# Altium schematic sheet Jlink_V9.SchDoc
size A4
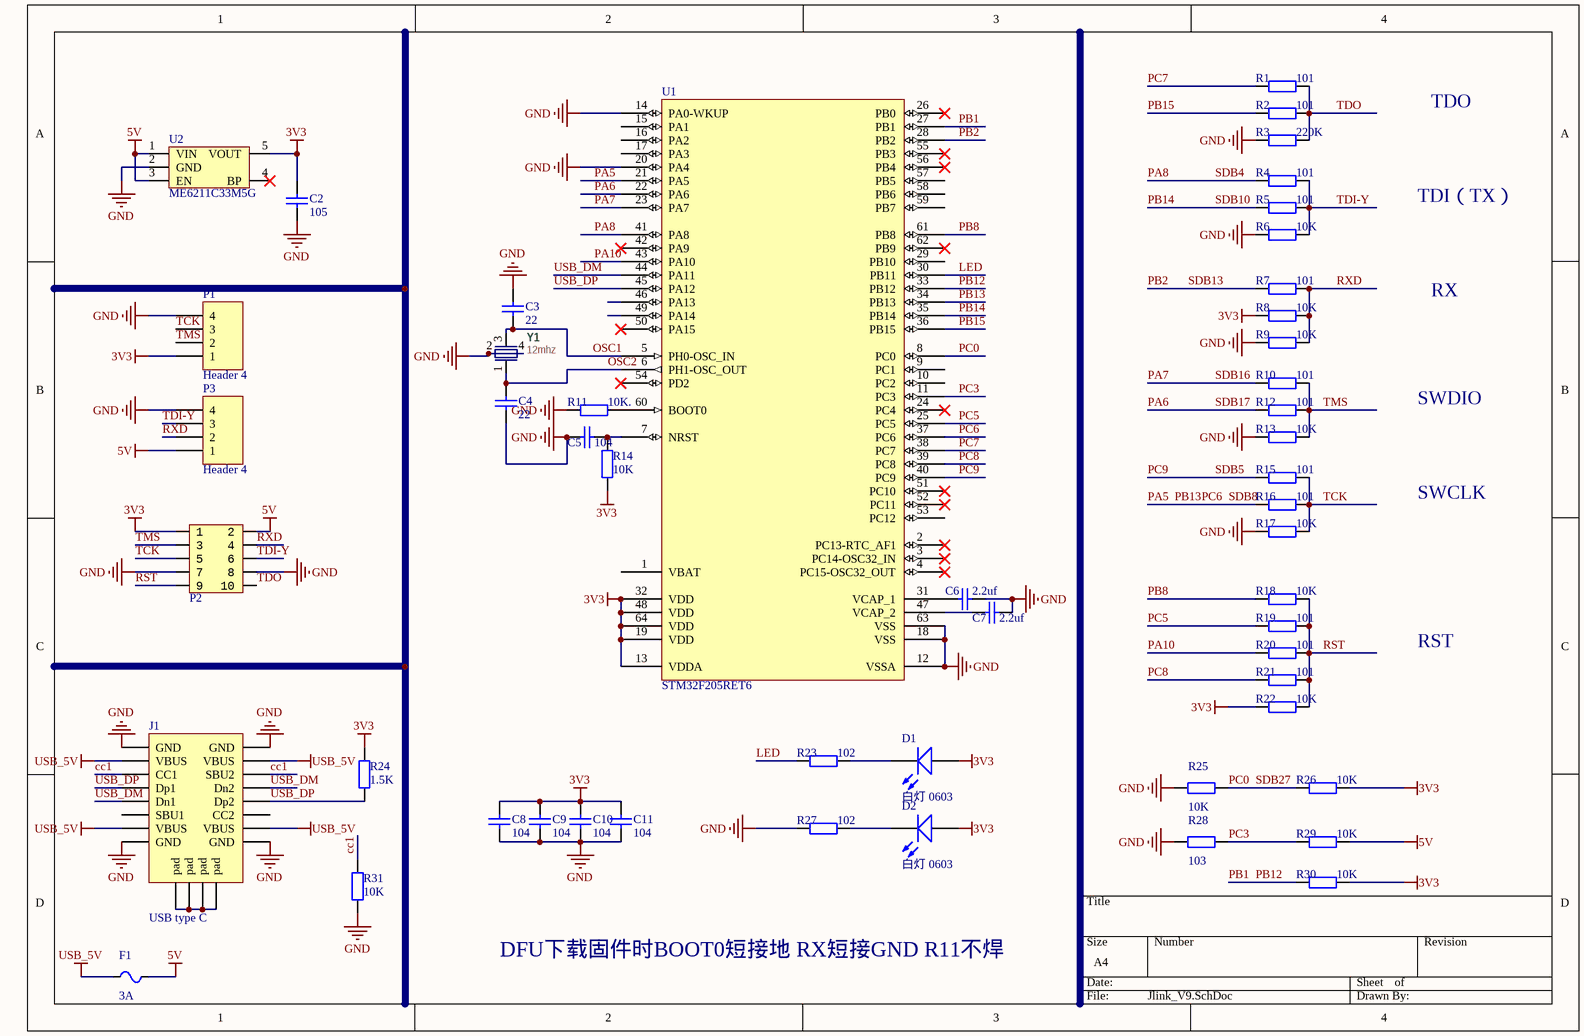
[diagram p0: Jlink_V9.SchDoc]

## Parts
C2  value 105  [LC-0603_C]  (hidden comment: 104)
C3  value 22  [LC-0603_C]  (hidden comment: 104)
C4  value 22  [LC-0603_C]  (hidden comment: 104)
C5  104  [LC-0603_C]
C6  2.2UF  [LC-0603_C]
C7  2.2UF  [LC-0603_C]
C8  104  [LC-0603_C]
C9  104  [LC-0603_C]
C10  104  [LC-0603_C]
C11  104  [LC-0603_C]
D1  白灯 0603  [0603_LED_S1]
D2  白灯 0603  [0603_LED_S1]
F1  3A  [FU 0603]
J1  USB type C  [USB Type-C-16Pin_A]
P1  Header 4  [SMT1.25_4P-90]
P2  HDR2x5  [HDR2X5_2.54_180HF]  (value not drawn)
P3  Header 4  [SMT1.25_4P-90]
R1  value 101  [LC-0603_R]  (hidden comment: 100R)
R2  value 101  [LC-0603_R]  (hidden comment: 100R)
R3  value 220K  [LC-0603_R]  (hidden comment: NC)
R4  value 101  [LC-0603_R]  (hidden comment: 100R)
R5  value 101  [LC-0603_R]  (hidden comment: 100R)
R6  10K  [LC-0603_R]
R7  value 101  [LC-0603_R]  (hidden comment: 100R)
R8  10K  [LC-0603_R]
R9  10K  [LC-0603_R]
R10  value 101  [LC-0603_R]  (hidden comment: 100R)
R11  value 10K.  [LC-0603_R]  (hidden comment: 10K)
R12  value 101  [LC-0603_R]  (hidden comment: 100R)
R13  10K  [LC-0603_R]
R14  10K  [LC-0603_R]
R15  value 101  [LC-0603_R]  (hidden comment: 100R)
R16  value 101  [LC-0603_R]  (hidden comment: 100R)
R17  10K  [LC-0603_R]
R18  10K  [LC-0603_R]
R19  value 101  [LC-0603_R]  (hidden comment: 100R)
R20  value 101  [LC-0603_R]  (hidden comment: 100R)
R21  value 101  [LC-0603_R]  (hidden comment: 10K)
R22  10K  [LC-0603_R]
R23  value 102  [LC-0603_R]  (hidden comment: 1K)
R24  1.5K  [LC-0603_R]
R25  10K  [LC-0603_R]
R26  10K  [LC-0603_R]
R27  value 102  [LC-0603_R]  (hidden comment: 1K)
R28  value 103  [LC-0603_R]  (hidden comment: 10K)
R29  10K  [LC-0603_R]
R30  10K  [LC-0603_R]
R31  10K  [LC-0603_R]
U1  STM32F205RET6  [LQFP64 10x10_N]
U2  ME6211C33M5G  [SOT23-5N]
Y1  12mhz  [OSC-3225]

## Nets
3V3: C2.2 C8.2 C9.2 C10.2 C11.2 D1.A D2.A P1.1 P2.1 R8.1 R14.1 R22.1 R24.1 R26.2 R30.2 U1.13(VDDA) U1.19(VDD) U1.32(VDD) U1.48(VDD) U1.64(VDD) U2.5(VOUT)
5V: F1.2 P2.2 P3.1 R29.2 U2.1(VIN) U2.3(EN)
GND: C2.1 C3.2 C4.1 C5.2 C6.1 C7.1 C8.1 C9.1 C10.1 C11.1 J1.A1(GND) J1.A12(GND) J1.B1(GND) J1.B12(GND) P1.4 P2.7 P2.8 P3.4 R3.1 R6.1 R9.1 R11.1 R13.1 R17.1 R25.1 R27.1 R28.1 R31.2 U1.12(VSSA) U1.14(PA0-WKUP) U1.18(VSS) U1.20(PA4) U1.63(VSS) U2.2(GND) Y1.2 Y1.4
USB_5V: F1.1 J1.A4(VBUS) J1.A9(VBUS) J1.B4(VBUS) J1.B9(VBUS)
cc1: J1.A5(CC1) J1.B8(SBU2) R31.1
LED: R23.1 U1.30(PB11)
OSC1: C3.1 U1.5(PH0-OSC_IN) Y1.3
OSC2: C4.2 U1.6(PH1-OSC_OUT) Y1.1
PA5: R16.1 U1.21(PA5) U1.34(PB13) U1.37(PC6)  [also labelled PB13, PC6, SDB8]
PA6: R12.1 U1.22(PA6)  [also labelled SDB17]
PA7: R10.1 U1.23(PA7)  [also labelled SDB16]
PA8: R4.1 U1.41(PA8)  [also labelled SDB4]
PA10: R20.1 U1.43(PA10)
PB1: R30.1 U1.27(PB1) U1.33(PB12)  [also labelled PB12]
PB2: R7.1 U1.28(PB2)  [also labelled SDB13]
PB8: R18.1 U1.61(PB8)
PB14: R5.1 U1.35(PB14)  [also labelled SDB10]
PB15: R2.1 U1.36(PB15)
PC0: R25.2 R26.1 U1.8(PC0)  [also labelled SDB27]
PC3: R28.2 R29.1 U1.11(PC3)
PC5: R19.1 U1.25(PC5)
PC7: R1.1 U1.38(PC7)
PC8: R21.1 U1.39(PC8)
PC9: R15.1 U1.40(PC9)  [also labelled SDB5]
RST: P2.9 R18.2 R19.2 R20.2 R21.2 R22.2
RXD: P2.4 P3.2 R7.2 R8.2 R9.2
TCK: P1.3 P2.5 R15.2 R16.2 R17.2
TDI-Y: P2.6 P3.3 R4.2 R5.2 R6.2
TDO: P2.10 R1.2 R2.2 R3.2
TMS: P1.2 P2.3 R10.2 R12.2 R13.2
USB_DM: J1.A7(Dn1) J1.B7(Dn2) U1.44(PA11)
USB_DP: J1.A6(Dp1) J1.B6(Dp2) R24.2 U1.45(PA12)
NetC5_1: C5.1 R14.2 U1.7(NRST)
NetC6_2: C6.2 U1.31(VCAP_1)
NetC7_2: C7.2 U1.47(VCAP_2)
NetD1_K: D1.K R23.2
NetD2_K: D2.K R27.2
NetR11_2: R11.2 U1.60(BOOT0)

Not connected (* = marked no-connect by the designer): J1 0(pad) A8(SBU1) B5(CC2); U1 1(VBAT) 2(PC13-RTC_AF1)* 3(PC14-OSC32_IN)* 4(PC15-OSC32_OUT)* 9(PC1) 10(PC2) 15(PA1) 16(PA2) 17(PA3) 24(PC4)* 26(PB0)* 29(PB10) 42(PA9)* 46(PA13) 49(PA14) 50(PA15)* 51(PC10)* 52(PC11)* 53(PC12) 54(PD2)* 55(PB3)* 56(PB4)* 57(PB5) 58(PB6) 59(PB7) 62(PB9)*; U2 4(BP)*

## Notes on the sheet
- TDO
- TDI（TX）
- RX
- SWDIO
- SWCLK
- RST
- DFU下载固件时BOOT0短接地 RX短接GND R11不焊

## Library data of the parts
C2-C11 = Cap: Polarized Capacitor (Radial); Published: 8-Jun-2000; Revision: July-2002: Re-released for DXP Platform.; Publisher: Altium Limited
  C5 C8-C11: Value: 104
  C6 C7: Value: 2.2uf
D1 D2 = 0603 白灯: 发光二极管; ComponentLink1Description: 供应商链接; ComponentLink1URL: http://www.szlcsc.com/product/details_2663.html; Package: 0603; Supplier: LC; SuppliersPartNumber: C2290
F1 = FU: 贴片保险丝; 版权归属: 源创客; BOM名称: 贴片保险丝; 学习资源: www.ooocke.com
J1 = USB_C
P1 P3 = Header 4: Header, 4-Pin; LatestRevisionDate: 17-Jul-2002; LatestRevisionNote: Re-released for DXP Platform.; Publisher: Altium Limited
P2 = HDR2x5_2.54: Header
R1-R23 R25-R30 = Resistor: Resistor Chip; Published: 8-Jun-2000; Revision: July-2002: Re-released for DXP Platform.; Publisher: Altium Limited
  R6 R8 R9 R13 R14 R17 R18 R22 R25 R26 R29 R30: Value: 10K
R24 R31 = Res2: Resistor; Published: 8-Jun-2000; LatestRevisionDate: 17-Jul-2002; LatestRevisionNote: Re-released for DXP Platform.; PackageReference: AXIAL-0.4; Publisher: Altium Limited
  R24: Value: 1.5K
  R31: Value: 10K
U1 = STM32F205RET6: Microcontroller   ST; Code: 104261; Vision: V5.0; Value: STM32F205RET6; LatestRevisionDate: 25-Mar-2015; PackageReference: SQFP10x10-64; Brand: ST; InitialReleaseDate: 25-Mar-2015
U2 = RT9193-33: 3.3V超低压差LDO
Y1 = XTAL: =Description